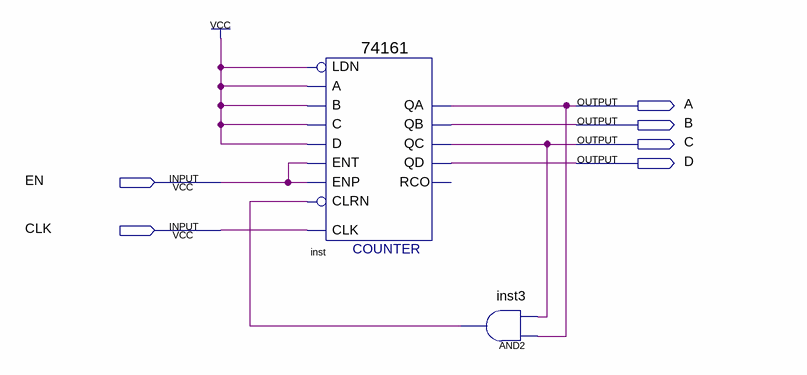
[diagram p0: schematic sheet]
// Quartus schematic CountMod5.bdf as structural Verilog: 2 symbols, 6 pins
module CountMod5 (
  input  EN,
  input  CLK,
  output A,
  output B,
  output C,
  output D
);

  wire inst3_out;

  \74161  inst (
    .CLRN(inst3_out), .CLK(CLK), .ENP(EN), .LDN(1'b1), .A(1'b1), .D(1'b1), .ENT(EN), .B(1'b1), .C(1'b1),
    .QD(D), .QC(C), .QB(B), .QA(A));  // open: RCO
  and inst3 (inst3_out, A, C);
endmodule
